# Altium project AUDIO EQUALIZER.PrjPcb
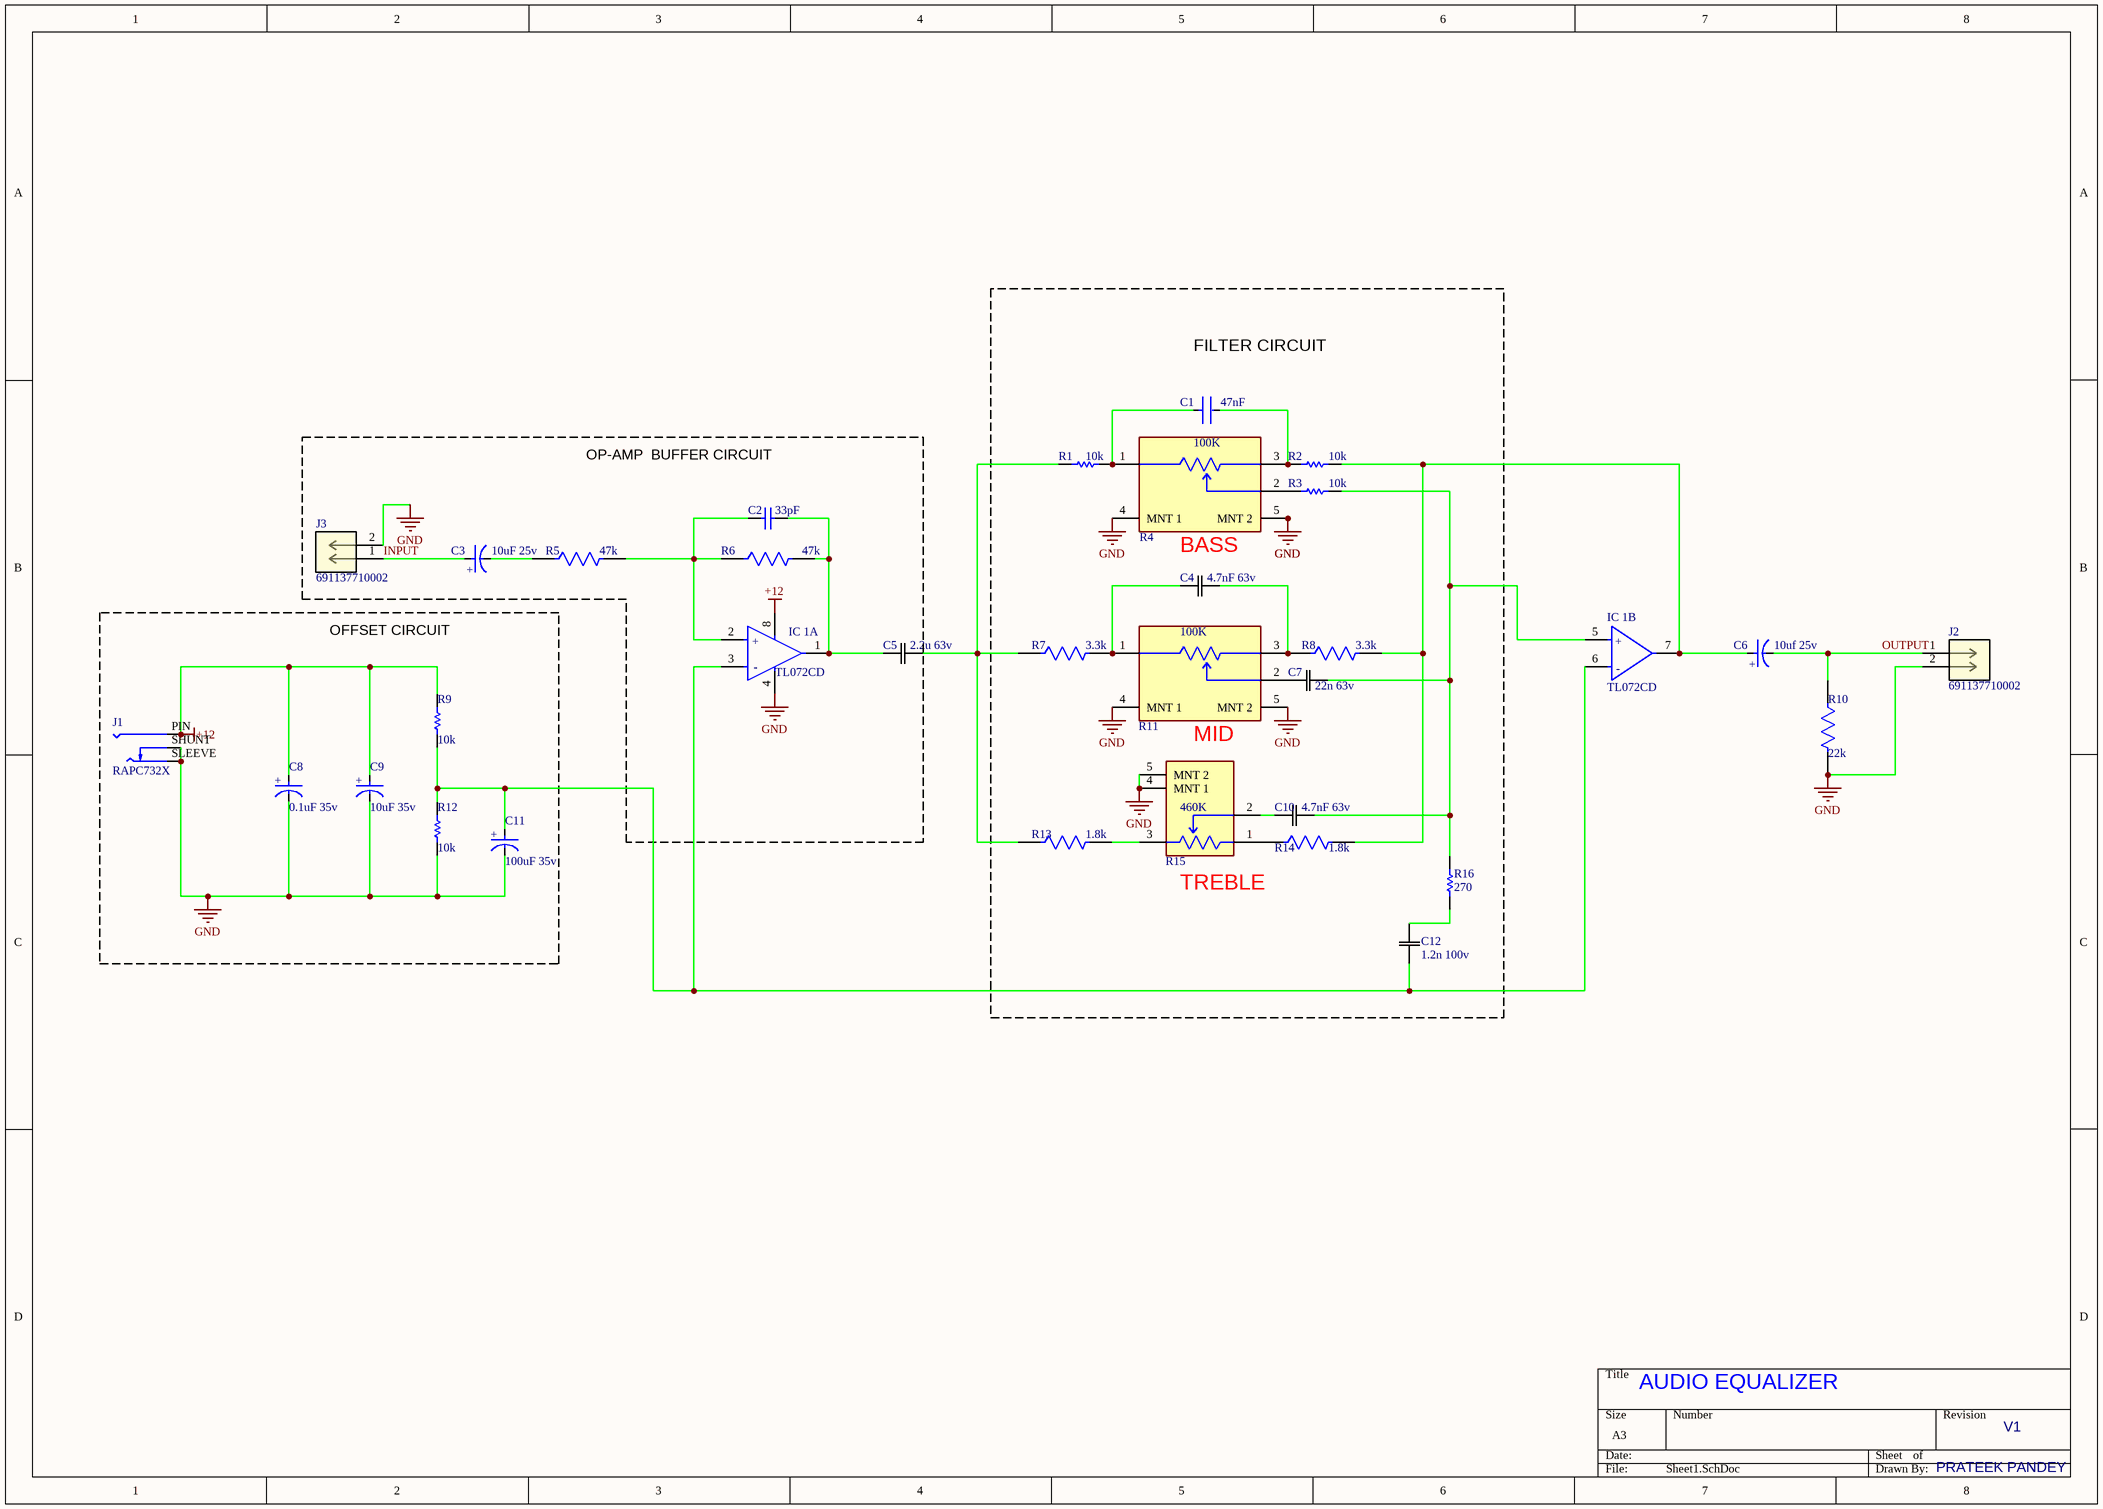
[diagram p0: Sheet1.SchDoc]
1 sheet, 32 parts. Net scope: global (net labels, ports and power ports of the same name join across sheets).
Board file: PCB1.PcbDoc

## Sheet Sheet1.SchDoc: AUDIO EQUALIZER
size A3; Author: PRATEEK PANDEY; DrawnBy: PRATEEK PANDEY; Engineer: PRATEEK PANDEY; Revision: V1; SheetNumber: 1; SheetTotal: 1

### Parts
C1  47nF  [FP-0805-L_2_01_0_2-W_1_25-MFG]
C2  33pF  [CAPC3216X94X50ML20T25]
C3  10uF 25v  [FP-T491D-MFG]
C4  4.7nF 63v  [CAP_R82E-7P4X2P6-5P0_KEM]
C5  2.2u 63v  [CAP_WCAP-ATG8_5x11_WRE]
C6  10uf 25v  [FP-T491D-MFG]
C7  22n 63v  [CAP_R82_2.5X6.5X7.2_ATN]
C8  0.1uF 35v  [FP-T491B105K035AT-MFG]
C9  10uF 35v  [FP-FKB-MFG]
C10  4.7nF 63v  [CAP_R82E-7P4X2P6-5P0_KEM]
C11  100uF 35v  [FP-FTD-MFG]
C12  1.2n 100v  [CAP_PHE_426_DJ_4100-5150_KEM]
IC_1  TL072CD  [FP-SO8-IPC_C]  (parts A,B of 2)
J1  RAPC732X  [SWITCHCRAFT_RAPC732X]
J2  691137710002  [CONN2_710002_WRE]
J3  691137710002  [CONN2_710002_WRE]
R1  10k  [RESC1609X50X30ML8T20]
R2  10k  [RESC1609X50X30ML8T20]
R3  10k  [RESC1609X50X30ML8T20]
R4  P0915N-FC15BR100K  [BI_Technologies_0_MFG]  (value not drawn)
R5  47k  [FP-CRCW0603-e3-IPC_A]
R6  47k  [FP-CRCW0603-e3-IPC_A]
R7  3.3k  [FP-CRCW0603-e3-IPC_A]
R8  3.3k  [FP-CRCW0603-e3-IPC_A]
R9  10k  [RESC1609X50X30ML8T20]
R10  22k  [FP-ERA3A-MFG]
R11  P0915N-FC15BR100K  [BI_Technologies_0_MFG]  (value not drawn)
R12  10k  [RESC1609X50X30ML8T20]
R13  1.8k  [FP-CRCW0603-e3-IPC_A]
R14  1.8k  [FP-CRCW0603-e3-IPC_A]
R15  PTV09A-4020F-A504  [Bourns_0_MFG]  (value not drawn)
R16  270  [RESC1608X55X30LL15T15]

### Blocks framed on the sheet
OP-AMP  BUFFER CIRCUIT: C2 C3 C5 IC_1 J3 R5 R6
OFFSET CIRCUIT: C8 C9 C11 J1 R9 R12

### Nets
+12: C8.2(A) C9.2(A) IC_1.8(VCC+) J1.PIN R9.2
GND: C8.1(C) C9.1(C) C11.1(C) IC_1.4(VCC-) J1.SHUNT J1.SLEEVE J2.2 J3.2 R4.4(MNT_1) R4.5(MNT_2) R10.2 R11.4(MNT_1) R11.5(MNT_2) R12.1 R15.4(MNT_1) R15.5(MNT_2)
INPUT: C3.2(A) J3.1
OUTPUT: C6.1(C) J2.1 R10.1
NetC1_1: C1.1 R1.2 R4.1
NetC1_2: C1.2 R2.1 R4.3
NetC2_1: C2.1 IC_1.2(Inverting_input_1) R5.2 R6.1
NetC2_2: C2.2 C5.1 IC_1.1(Output_1) R6.2
NetC3_1: C3.1(C) R5.1
NetC4_1: C4.1 R7.2 R11.1
NetC4_2: C4.2 R8.1 R11.3
NetC5_2: C5.2 R1.1 R7.1 R13.1
NetC6_2: C6.2(A) IC_1.7(Output_2) R2.2 R8.2 R14.2
NetC7_1: C7.1 C10.2 IC_1.5(Non-inverting_input_2) R3.2 R16.2
NetC7_2: C7.2 R11.2
NetC10_1: C10.1 R15.2
NetC11_2: C11.2(A) C12.1 IC_1.3(Non-inverting_input_1) IC_1.6(Inverting_input_2) R9.1 R12.2
NetC12_2: C12.2 R16.1
NetR3_1: R3.1 R4.2
NetR13_2: R13.2 R15.3
NetR14_1: R14.1 R15.1

### Notes on the sheet
- FILTER CIRCUIT
- (near R4) 100K
- BASS
- (near R11) 100K
- MID
- (near R15) 460K
- (near R15) TREBLE
- AUDIO EQUALIZER
- V1
- PRATEEK PANDEY
- (in symbol CMP-2000-06211-2) +
- (in symbol CMP-2000-07200-2) +
- (in symbol CMP-03017-000043-1) +
- (in symbol CMP-05427-000027-1) +
- (in symbol CMP-12131-000015-1, part A) +
- (in symbol CMP-12131-000015-1, part B) +

### Library data of the parts
C1 = CMP-04427-003357-1: General Purpose Ceramic Capacitor, 0805, 47nF, 10%, X8R, 15%, 50V; Case/Package: 0805; Voltage Rating (DC): 50V; Min Operating Temperature: -55°C; Number of Pins: 2; Depth: 1.25mm; Case Code (Imperial): 0805; Case Code (Metric): 2012; Voltage: 50V; Tolerance: 10%; Construction: Flat; Voltage Rating: 50V; REACH SVHC: No SVHC; Dielectric: X8R; Radiation Hardening: No; Dielectric Material: Ceramic; RoHS Compliant: Yes; Max Operating Temperature: 150°C; Length: 2.01mm; Height: 0.94mm; Packaging: Tape and Reel; Mount: Surface Mount; Termination: SMD/SMT; Capacitance: 47nF; Series: FlEXITERM
C2 = CMP-1037-01149-2: Chip Capacitor, 33 pF, +/- 5%, 100 V, -55 to 125 degC, 1206 (3216 Metric), RoHS, Tape and Reel; Manufacturer: AVX; Dielectric: C0G/NP0; Rated Voltage: 100V; Datasheet Version: 04/2016; Package Reference: 1206; Manufacturer URL: http://www.avx.com/; Package Description: 2-Pin Surface Mount Device, Body 3.2 x 1.6 mm; Capacitance: 33pF; Mounting Technology: SurfaceMount; Case Size/Dimension: 1206; Datasheet URL: http://datasheets.avx.com/C0GNP0-Dielectric.pdf; Tolerance (%): ±5%
C3 C6 = CMP-2000-07200-2: CAP TANT 10UF 10% 25V 2917; Tolerance: 20%; Life (Hours): 2000Hour; Dielectric Material: Tantalum; Dissipation Factor: 6%; Leakage Current: 2.5uA; Ripple Current: 387mA; Polarity: Polar; ESR (Equivalent Series Resistance): 1R; Voltage: 25V; Capacitance: 10uF; Voltage Rating: 25V; Voltage Rating (DC): 25V; Depth: 4.3mm; Mount: Surface Mount; Length: 7.3mm; Termination: SMD/SMT; Radiation Hardening: No; Max Operating Temperature: 125°C; REACH SVHC: No SVHC; Height: 2.8mm; Package Quantity: 1; Packaging: Tape and Reel; Case Code (Imperial): 2917; Width: 4.3mm; Min Operating Temperature: -55°C; Features: General Purpose; Case Code (Metric): 7343; Height - Seated (Max): 0.122inch; Number of Pins: 2; Lead Free: Lead Free; Case/Package: 2917
C4 C10 = R82EC1470DQ50K: No Description Available; Mfr_Name: Kemet; Type: Film Capacitor
C5 = 860010772006: No Description Available; Mfr_Name: Wurth Electronics
C7 = R82EC2220DQ50J: No Description Available; Mfr_Name: Kemet / Arcotronics
C8 = CMP-03017-000043-1: CAP TANT 1UF 10% 35V 1411; Life (Hours): 2000Hour; Dissipation Factor: 4%; Dielectric Material: Tantalum; ESR (Equivalent Series Resistance): 5R; Ripple Current: 130mA; Polarity: Polar; Leakage Current: 500nA; Tolerance: 20%; Packaging: Tape and Reel; Capacitance: 1uF; Package Quantity: 1; Case Code (Imperial): 1411; Voltage: 35V; Depth: 2.8mm; Radiation Hardening: No; Voltage Rating (DC): 35V; Max Operating Temperature: 125°C; REACH SVHC: No SVHC; Case/Package: 1411; Lead Free: Lead Free; Height - Seated (Max): 0.083inch; Length: 3.5mm; Features: General Purpose; Height: 1.9mm; Mount: Surface Mount; Voltage Rating: 35V; Min Operating Temperature: -55°C; Width: 2.8mm; Case Code (Metric): 3528; Termination: SMD/SMT; Number of Pins: 2
C9 = CMP-2000-06211-2: CAP ALUM 10UF 20% 35V SMD; ESR (Equivalent Series Resistance): 1.35R; Ripple Current: 90mA; Leakage Current: 3uA; Polarity: Polar; Material: Aluminium; Life (Hours): 2000Hour; Height: 5.8mm; Voltage Rating: 35V; Max Operating Temperature: 105°C; Ripple Current (AC): 90mA; Voltage: 35V; Height - Seated (Max): 0.24inch; Lead Free: Lead Free; Contact Plating: Tin; Capacitance: 10uF; Series: FK; REACH SVHC: No SVHC; Construction: Cylindrical; Tolerance: 20%; Voltage Rating (DC): 35V; Number of Pins: 2; Packaging: Tape and Reel; RoHS Compliant: Yes; Min Operating Temperature: -55°C; Impedance: 1.35R; Package Quantity: 1; Termination: SMD/SMT; Length: 5.8mm; Case/Package: Radial; Diameter: 4mm; Radiation Hardening: No; Width: 5.5mm; Mount: Surface Mount
C11 = CMP-05427-000027-1: CAP ALUM 100UF 20% 35V SMD; Ripple Current: 300mA; Polarity: Polar; Life (Hours): 2000Hour; Lead Diameter: 0.65mm; ESR (Equivalent Series Resistance): 260mR; Leakage Current: 35uA; REACH SVHC: No SVHC; Series: FT; Min Operating Temperature: -55°C; Diameter: 6.3mm; Max Operating Temperature: 105°C; Number of Pins: 2; Package Quantity: 1000; Length: 5.8mm; Lead Pitch: 1.8mm; Voltage: 35V; Construction: Cylindrical; Capacitance: 100uF; Height: 5.8mm; Tolerance: 20%; RoHS Compliant: Yes; Packaging: Tape and Reel; Ripple Current (AC): 300mA; Height - Seated (Max): 0.24inch; Voltage Rating: 35V; Radiation Hardening: No; Contact Plating: Tin; Termination: SMD/SMT; Voltage Rating (DC): 35V; Case/Package: Radial; Mount: Surface Mount
C12 = PHE426DJ4120JR05: No Description Available; Mfr_Name: Kemet
IC_1 = CMP-12131-000015-1: IC OPAMP JFET 2 CIRCUIT 8SO; Unity Gain Bandwidth Product: 4MHz; Max Supply Voltage: 36V; Max Dual Supply Voltage: 18V; Voltage Gain: 106.02dB; Output Current: 40mA; Input Offset Voltage (Vos): 10mV; Slew Rate-Nom: 13V/µs; Min Input Voltage: -12V; Number of Channels: 2; Common Mode Rejection Ratio: 70dB; Dual Supply Voltage: 15V; Supply Current: 2.5mA; Input Offset Voltage-Max: 3mV; Slew Rate: 16V/µs; Min Dual Supply Voltage: 3V; Amplifier Type: LOW NOISE; Operating Supply Current: 1.4mA; Input Bias Current: 200pA; Height: 1.25mm; REACH SVHC: No SVHC; Lead Free: Lead Free; Series: -; Width: 4mm; Packaging: Rail/Tube; Max Operating Temperature: 70°C; Length: 5mm; Number of Amplifiers: 2; Number of Elements: 2; Gain Bandwidth Product: 4MHz; Operating Supply Voltage: 18V; Number of Pins: 8; Case/Package: SO; Mount: Surface Mount; Max Input Voltage: 15V; Number of Circuits: 2; Radiation Hardening: No; Min Operating Temperature: 0°C; Nominal Supply Current: 2.5mA; Technology: BIFET; Output Current per Channel: 40mA; Package Quantity: 100; RoHS Compliant: Yes
J1 = RAPC732X: Power Barrel Connector Jack 2.50mm ID (0.098"), 5.50mm OD (0.217") Through Hole, Right Angle; Package: None; Price: None; Value: *; MP: RAPC732X; Availability: Unavailable
J2 J3 = 691137710002: No Description Available; Mfr_Name: Wurth Electronics; RefDes: RefDes; Type: Type
R1-R3 R9 R12 = CMP-1666-00005-4: Chip Resistor, 10 KOhm, +/- 1%, 100 mW, -55 to 155 degC, 0603 (1608 Metric), RoHS, Tape and Reel; Manufacturer: Vishay Semiconductor; Voltage Rating: 75 V; Max Operating Temperature: 155 degC; PackageDescription: 2-Pin Surface Mount Device, Body 1.575 x 0.85 mm; ComponentLink1Description: Manufacturer URL; RoHSCompliant: true; PackageReference: 0603; REACH SVHC: Unknown; Length: 1.55 mm; DatasheetVersion: 06/2012; Packaging: Tape and Reel; Min Operating Temperature: -55 degC; Mounting Technology: Surface Mount; ComponentLink2URL: https://datasheet.ciiva.com/11809/0900766b80d98afc-11809037.pdf; Height: 0.45 mm; ComponentLink2Description: Datasheet; Package Quantity: 5000; ComponentLink1URL: http://www.vishay.com/
R5 R6 = CMP-2000-03379-3: RES SMD 47K OHM 1% 1/10W 0603; Voltage Rating: 75V; Max Power Dissipation: 100mW; Resistance: 47kR; Temperature Coefficient: 100ppm/°C; Size Code: 0603; Technology: THICK FILM; Case Code (Metric): 1608; Radiation Hardening: No; Case/Package: 0603; Number of Terminations: 2; Package Quantity: 5000; Width: 0.85mm; Series: CRCW; RoHS Compliant: Yes; Case Code (Imperial): 0603; Lead Free: Lead Free; Resistance Tolerance: 1%; Depth: 0.85mm; Contact Plating: Tin; Tolerance: 1%; Voltage Rating (DC): 75V; Min Operating Temperature: -55°C; Mount: Surface Mount; Packaging: Tape and Reel; Length: 1.55mm; Resistor Type: Thick Film; Features: Automotive AEC-Q200; Max Operating Temperature: 155°C; Weight: 7.1E-05oz; Construction: Rectangular; Height: 0.45mm; Military Standard: Not; Termination: SMD/SMT; Power Rating: 100mW
R7 R8 = CMP-2100-03614-2: RES Thick Film, 3.3kΩ, 1%, 0.1W, 100ppm/°C, 0603; Resistance: 3.3kR; Power Rating: 100mW; Voltage Rating (DC): 75V; Height: 0.45mm; Lead Free: Lead Free; Min Operating Temperature: -55°C; Number of Terminations: 2; Mount: Surface Mount; Max Operating Temperature: 155°C; Package Quantity: 10; Radiation Hardening: No; Features: Automotive AEC-Q200; Depth: 0.85mm; Case Code (Metric): 1608; Termination: SMD/SMT; Width: 0.85mm; Length: 1.55mm; Case Code (Imperial): 0603; Contact Plating: Tin; Temperature Coefficient: 100ppm/°C; Weight: 7.1E-05oz; Packaging: Tape and Reel; Tolerance: 1%; Military Standard: Not; Case/Package: 0603; Working Voltage: 75V; Max Power Dissipation: 100mW; Voltage Rating: 75V; Composition: Thick Film
R10 = CMP-2000-00956-2: RES SMD 22K OHM 0.1% 1/10W 0603; Resistance: 22kR; Temperature Coefficient: 25ppm/°C; Voltage Rating (DC): 75V; Max Power Dissipation: 100mW; Mount: Surface Mount; Length: 1.6mm; Height: 0.45mm; Case/Package: 0603; Depth: 0.8mm; Number of Pins: 2; Width: 0.8mm; Resistance Tolerance: 0.1%; Construction: Rectangular; RoHS Compliant: Yes; Tolerance: 0.1%; Case Code (Metric): 1608; Power Rating: 100mW; Number of Terminations: 2; REACH SVHC: No SVHC; Radiation Hardening: No; Max Operating Temperature: 155°C; Lead Free: Lead Free; Resistor Type: Thin Film; Technology: THIN FILM; Termination: Solder; Packaging: Tape and Reel; Min Operating Temperature: -55°C; Contact Plating: Tin; Voltage Rating: 75V; Military Standard: Not; Series: ERA-3A; Package Quantity: 1; Size Code: 0603; Case Code (Imperial): 0603; Features: Automotive AEC-Q200
R13 R14 = CMP-02407-005782-1: RES Thick Film, 1.8kΩ, 1%, 0.1W, 100ppm/°C, 0603; Voltage Rating (DC): 75V; Max Power Dissipation: 100mW; Resistance: 1.8kR; Depth: 0.85mm; Contact Plating: Tin; Max Operating Temperature: 155°C; Package Quantity: 5000; Radiation Hardening: No; Temperature Coefficient: 100ppm/°C; Packaging: Tape and Reel; Number of Terminations: 2; Case Code (Imperial): 0603; Lead Free: Lead Free; Case/Package: 0603; Military Standard: Not; Weight: 7.1E-05oz; Tolerance: 1%; Height: 0.45mm; Min Operating Temperature: -55°C; Length: 1.55mm; Voltage Rating: 75V; Power Rating: 100mW; Width: 0.033inch; Composition: Thick Film; Case Code (Metric): 1608; Termination: SMD/SMT; Features: Automotive AEC-Q200
R16 = CMP-2000-00388-1: Manufacturer: Panasonic; Part Number: ERJ3EKF2700V